# EAGLE design dragonite (EAGLE 6.2)
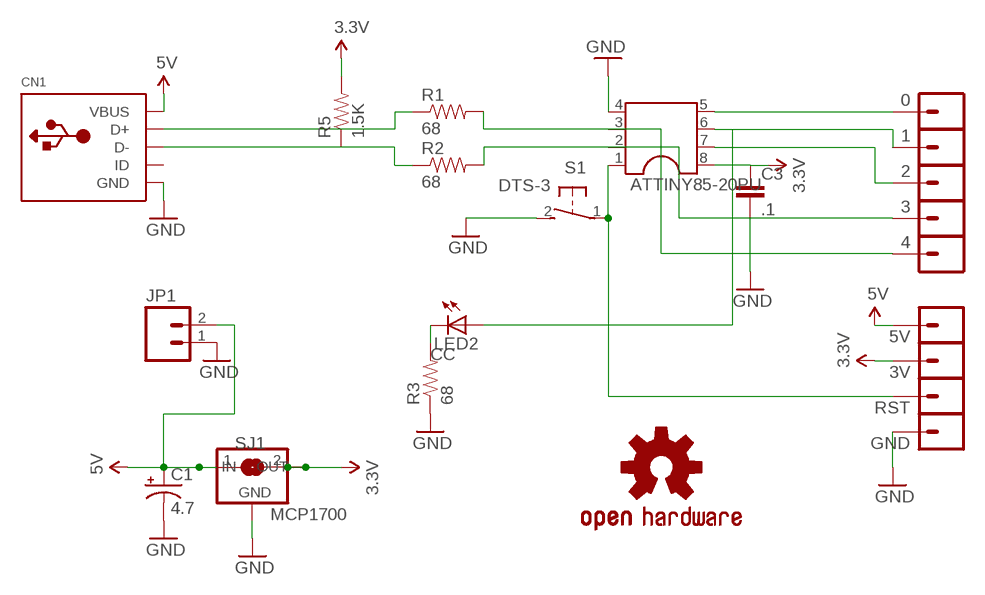
[diagram p0: schematic, sheet 1]

## Parts
0  M01SMDNS  [1X01NS]
1  M01SMDNS  [1X01NS]
2  M01SMDNS  [1X01NS]
3  M01SMDNS  [1X01NS]
3V  M01SMDNS  [1X01NS]
4  M01SMDNS  [1X01NS]
5V  M01SMDNS  [1X01NS]
ATTINY85-20PU  DIL8  [DIL08]
C1  4.7  CPOL-USE2-4  [E2-4]
C3  .1  CAPEZ  [CAP-PTH-SMALLEZ]
CN1  USBMOLEX  [USB-MINIB-THM-MOLEX]
GND  M01SMDNS  [1X01NS]
JP1  M02JST-PTH-2  [JST-2-PTH]
LED2  LED3MM  [LED3MM]
MCP1700  V_REG_78XXTO-92  [TO-92]
R1  68  RESISTORPTH-1/6W  [1/6W-RES]
R2  68  RESISTORPTH-1/6W  [1/6W-RES]
R3  68  RESISTORPTH-1/6W  [1/6W-RES]
R5  1.5K  RESISTORPTH-1/6W  [1/6W-RES]
RST  M01SMDNS  [1X01NS]
S1  DTS-3  [DTS-3]
SJ1  JUMPER_SJSJ_SMALLER  [JUMPER_SJ_1_SMALLER]
U$4  OSHW-LOGOS  [OSHW-LOGO-S]

## Nets
3.3V: 3V.1 ATTINY85-20PU.8 C3.1 MCP1700.3(OUT) R5.2 SJ1.2
5V: 5V.1 C1.+ CN1.VBUS JP1.2 MCP1700.2(IN) SJ1.1
GND: ATTINY85-20PU.4 C1.- C3.2 CN1.GND GND.1 JP1.1 MCP1700.1(GND) R3.1 S1.2
N$1: CN1.D+ R1.1
N$2: CN1.D- R2.1 R5.1
N$3: LED2.K(C) R3.2
N$5: ATTINY85-20PU.1 RST.1 S1.1
N$7: 4.1 ATTINY85-20PU.3 R1.2
N$8: 3.1 ATTINY85-20PU.2 R2.2
N$9: 0.1 ATTINY85-20PU.5
N$10: 1.1 ATTINY85-20PU.6 LED2.A
N$11: 2.1 ATTINY85-20PU.7
Unconnected: CN1.ID

## Notes on the sheet
- CC

## Library data of the parts
0 1-3 3V 4 5V GND RST = SparkFun:M01: Header 1 Standard 1-pin 0.1" header. Use with straight break away headers (SKU : PRT-00116), right angle break away headers (PRT-00553), swiss pins (PRT-00743), machine pins (PRT-00117), and female headers (PRT-00115).
ATTINY85-20PU = ic-package:DIL8: Dual In Line / Socket
C1 = adafruit:CPOL-US: POLARIZED CAPACITOR, American symbol
C3 = SparkFun-Capacitors:CAP: Capacitor Standard 0603 ceramic capacitor, and 0.1" leaded capacitor.
CN1 = adafruit:USB: USB Connectors USBMINIB - Surface Mount Female Mini-B USB Connector 4UConnector: 06564 By microbuilder.eu Thru-hole RA Female Mini-B USB Connector 4UConnector: 18732 By ladyada.net
JP1 = SparkFun:M02: Header 2 Standard 2-pin 0.1" header. Use with straight break away headers (SKU : PRT-00116), right angle break away headers (PRT-00553), swiss pins (PRT-00743), machine pins (PRT-00117), and female headers (PRT-00115). Molex polarized connector foot print use with SKU : PRT-08233 with associated crimp pins and housings.
LED2 = SparkFun-LED:LED: LEDs Standard schematic elements and footprints for 5mm, 3mm, 1206, and 0603 sized LEDs. 5mm - Spark Fun Electronics SKU : COM-00529 (and others)
MCP1700 = SteveMarple:V_REG_78XX: Voltage Regulator Standard 7805 5V regulator. IGO (Input Ground Output). Spark Fun Electronics SKU : COM-00107
R1-R3 R5 = SparkFun:RESISTOR: Resistor Basic schematic elements and footprints for 0603, 1206, and PTH resistors.
S1 = switch-tact:DTS-3
SJ1 = iMX233-OLINUXINO-MAXI_Rev_B1:JUMPER_SJ: SMD solder JUMPER
U$4 = SparkFun:OSHW-LOGO: Open Source Hardware Logo This logo indicates the piece of hardware it is found on incorporates a OSHW license and/or adheres to the definition of open source hardware found here: http://freedomdefined.org/OSHW

## Board
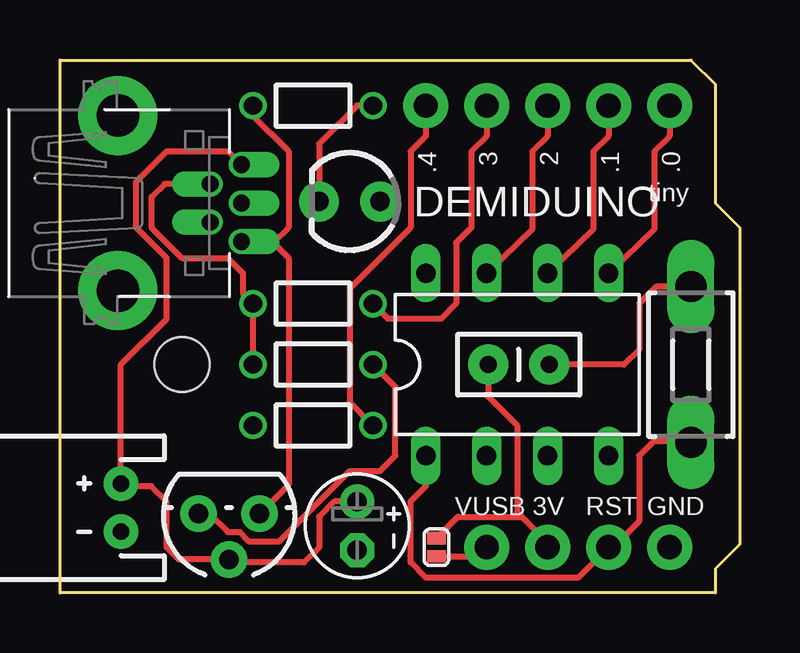
[diagram p1: board, top side]
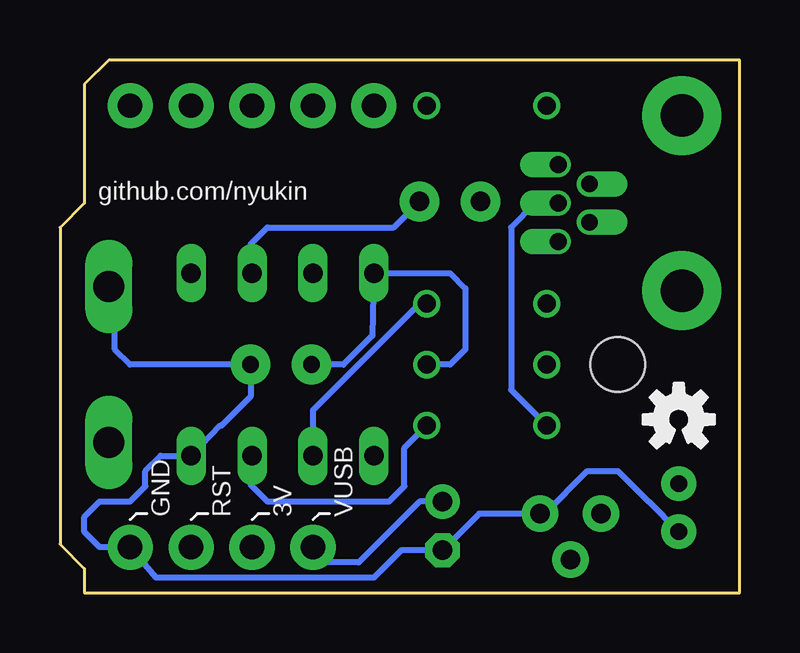
[diagram p2: board, bottom side, seen from below]

Size 28.32 x 22.23 mm. Coordinates in mm from the lower left corner, seen from the top.
Outline: 0,0 0,22.23 26.29,22.23 27.3,21.21 27.3,16.26 28.32,15.24 28.32,2.03 27.3,1.02 27.3,0 0,0
Copper layers (1*16): Top 0.0356mm / dielectric 1.5011mm / Bottom 0.0356mm
Design rules: minimum track width 6mil, minimum drill 13mil, track to track 6mil, track to pad 6mil, pad to pad 6mil, via to via 6mil, smd to smd 6mil, copper to edge 15mil, drill to drill 6mil, minimum pad ring 7mil, minimum via ring 7mil, stop-mask expansion 3mil, vias tented up to drill 14mil, thermal gap 10mil
Holes 2.29 mm at 5.08,9.53

### Footprints (pad centres in the part's own frame; a part is rotated, then mirrored left to right if it is on the bottom)
1X01NS = drill 1.016 pad 1.88: 1 0,0
DIL08 = drill 0.813 long: 1 -3.81,-3.81; 2 -1.27,-3.81; 3 1.27,-3.81; 4 3.81,-3.81; 5 3.81,3.81; 6 1.27,3.81; 7 -1.27,3.81; 8 -3.81,3.81
E2-4 = drill 0.813 pad 1.422: + -1.016,0 | drill 0.813 pad 1.422 octagon: - 1.016,0
CAP-PTH-SMALLEZ = drill 0.7 pad 1.651: 1 0,0; 2 2.54,0
USB-MINIB-THM-MOLEX = drill 0.7 offset: D+ 0,9.72; D- -0.8,8.42; GND 1.6,9.72; ID 0.8,8.42; VBUS -1.6,9.72 | drill 1.778 pad 3.302: GND1 -3.65,4.57; GND4 3.65,4.57
JST-2-PTH = drill 0.7 pad 1.448: 1 -1,0; 2 1,0
LED3MM = drill 0.813 pad 1.651: A -1.27,0; K 1.27,0
TO-92 = drill 0.813 pad 1.524: 1 -1.27,0; 2 0,1.905; 3 1.27,0
1/6W-RES = drill 0.762: 1 -2.5,0; 2 2.5,0
DTS-3 = drill 1.3 long: 1 -3.25,0; 2 3.25,0
JUMPER_SJ_1_SMALLER = smd 0.508 x 0.762: 1 -0.381,0; 2 0.381,0

### Placement (x,y rotation side)
0  25.4,20.32 0 top
1  22.86,20.32 0 top
2  20.32,20.32 0 top
3  17.78,20.32 0 top
3V  20.32,1.91 0 top
4  15.24,20.32 0 top
5V  17.78,1.91 0 top
ATTINY85-20PU  19.05,9.53 0 top
C1  12.38,2.79 270 top
C3  17.84,9.53 0 top
CN1  -2.16,16.26 270 top
GND  25.4,1.91 0 top
JP1  2.54,3.56 90 top
LED2  12.06,16.32 180 top
MCP1700  7.05,3.3 180 top
R1  10.54,6.99 0 top
R2  10.54,12.06 0 top
R3  10.54,20.32 0 top
R5  10.54,9.53 0 top
RST  22.86,1.91 0 top
S1  26.29,9.53 90 top
SJ1  15.68,1.91 90 top
U$4  2.54,7.24 0 bottom

### Tracks (layer width: path | path; a pad name or v marks a point on that pad's centre or on a via)
3.3V
  Top 0.254: 19.24,3.17 16.57,3.17 SJ1.2 | MCP1700.3 6.22,3.3 6.99,2.54 7.49,2.54 7.87,2.16 9.14,2.16 12.06,5.08 13.34,5.08 13.97,5.71 13.97,8.6 R5.2 | C3.1 17.84,8.19 19.05,6.99 19.05,3.37 19.24,3.17 | 3V.1 20.32,2.1 19.24,3.17
  Bottom 0.254: C3.1 16.51,9.53 15.3,10.73 ATTINY85-20PU.8 12.06,13.34 11.43,12.7 11.43,10.16 12.06,9.53 R5.2
5V
  Top 0.254: C1.+ 11.43,3.81 10.79,3.17 10.79,1.91 10.16,1.27 7.18,1.27 7.18,1.4 MCP1700.2 4.95,1.4 4.45,1.91 4.45,3.81 3.81,4.45 2.65,4.45 JP1.2 2.54,9.53 4.45,11.43 4.45,13.97 3.17,15.24 3.17,17.14 4.45,18.41 7,18.41 CN1.VBUS | SJ1.1 17.59,1.52 5V.1
  Bottom 0.254: C1.+ 13.34,3.81 15.88,1.27 17.34,1.27 5V.1
GND
  Top 0.254: S1.2 24.84,12.78 24.13,12.06 24.13,10.16 23.5,9.53 C3.2 | R3.1 8.04,19.9 9.53,18.41 9.53,15.24 8.89,14.61 7.61,14.61 CN1.GND 8.84,14.66 9.53,13.97 9.53,4.51 MCP1700.1
  Bottom 0.254: S1.2 26.04,12.52 26.04,10.16 25.4,9.53 C3.2 20.38,8.19 21.59,6.99 21.65,6.99 ATTINY85-20PU.4 24.13,5.71 24.77,5.08 24.77,4.45 25.4,3.81 26.67,3.81 27.3,3.17 27.3,2.54 26.67,1.91 GND.1 24.32,0.64 15.24,0.64 14.1,1.78 C1.- 10.86,3.3 MCP1700.1 8.13,3.3 6.35,5.08 5.08,5.08 3.81,3.81 3.79,3.81 JP1.1
N$1
  Bottom 0.254: CN1.D+ 8.51,16.26 9.53,15.24 9.53,8.47 R1.1
N$2
  Top 0.254: CN1.D- 4.36,17.06 3.81,16.51 3.81,15.24 5.08,13.97 6.99,13.97 7.62,13.34 7.62,12.49 R2.1 R5.1
N$3
  Top 0.254: R3.2 12.38,20.32 10.79,18.73 LED2.K
N$5
  Top 0.254: S1.1 26.21,6.35 24.77,6.35 24.13,5.71 24.13,2.98 23.05,1.91 RST.1 21.59,0.64 15.24,0.64 14.61,1.27 14.61,3.81 15.24,4.45 ATTINY85-20PU.1
N$7
  Top 0.254: R1.2 12.06,7.96 12.06,12.7 14.61,15.24 14.61,18.41 15.24,19.05 4.1
  Bottom 0.254: ATTINY85-20PU.3 20.38,4.51 19.68,3.81 14.61,3.81 13.97,4.45 13.97,6.06 R1.2
N$8
  Top 0.254: R2.2 13.68,11.43 15.88,11.43 16.51,12.06 16.51,14.61 17.14,15.24 17.14,18.41 17.78,19.05 3.1
  Bottom 0.254: R2.2 13.34,12.06 17.78,7.62 ATTINY85-20PU.2
N$9
  Top 0.254: ATTINY85-20PU.5 24.77,15.18 24.77,18.41 25.4,19.05 0.1
N$10
  Top 0.254: ATTINY85-20PU.6 22.23,15.18 22.23,18.41 22.86,19.05 1.1
  Bottom 0.254: ATTINY85-20PU.6 20.38,14.54 19.68,15.24 14.41,15.24 LED2.A
N$11
  Top 0.254: ATTINY85-20PU.7 19.68,15.18 19.68,18.41 20.32,19.05 2.1

### Text on the board
tPlace: /Users/wade/2.bmp | /Users/wade/2.bmp
tNames: .4 | 3 | 2 | .1 | .0 | DEMIDUINO | tiny | VUSB | 3V | RST | GND | /Users/wade/2.bmp
bNames: github.com/nyukin | VUSB | 3V | RST | GND
200bmp: /Users/wade/2.bmp